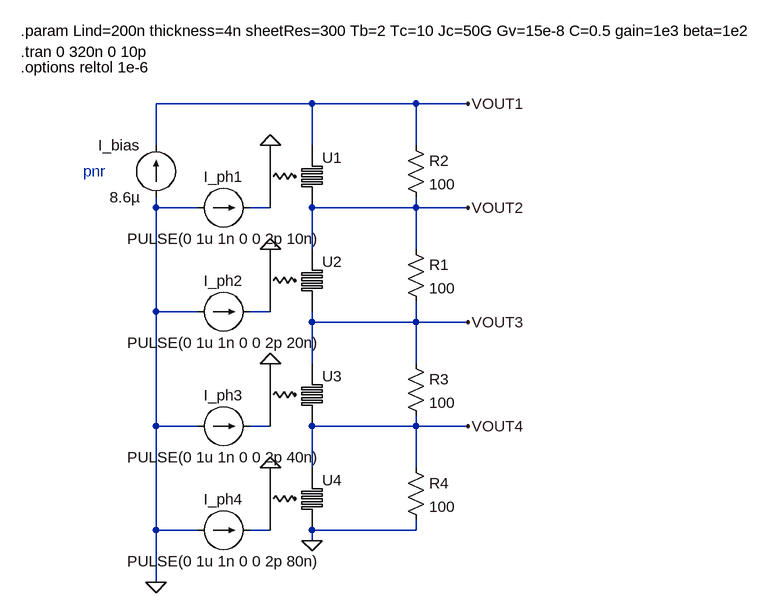
[diagram p0: schematic pnr-thermal.asc]
pnr-thermal.asc, the LTspice schematic file:
Version 4
SHEET 1 1508 680
WIRE -48 -608 -288 -608
WIRE 112 -608 -48 -608
WIRE 192 -608 112 -608
WIRE -288 -544 -288 -608
WIRE -48 -544 -48 -608
WIRE 112 -544 112 -608
WIRE -288 -448 -288 -464
WIRE -224 -448 -288 -448
WIRE -112 -448 -144 -448
WIRE 112 -448 112 -464
WIRE 112 -448 -48 -448
WIRE 192 -448 112 -448
WIRE -48 -384 -48 -448
WIRE 112 -384 112 -448
WIRE -288 -288 -288 -448
WIRE -224 -288 -288 -288
WIRE -112 -288 -144 -288
WIRE -48 -272 -48 -288
WIRE 112 -272 112 -304
WIRE 112 -272 -48 -272
WIRE 192 -272 112 -272
WIRE -48 -208 -48 -272
WIRE 112 -208 112 -272
WIRE -288 -112 -288 -288
WIRE -224 -112 -288 -112
WIRE -112 -112 -144 -112
WIRE -48 -112 -48 -128
WIRE 112 -112 112 -128
WIRE 112 -112 -48 -112
WIRE 192 -112 112 -112
WIRE -48 -48 -48 -112
WIRE 112 -48 112 -112
WIRE -288 48 -288 -112
WIRE -224 48 -288 48
WIRE -112 48 -144 48
WIRE 112 48 112 32
WIRE 112 48 -48 48
WIRE -48 64 -48 48
WIRE -288 128 -288 48
FLAG 192 -608 VOUT1
FLAG 192 -272 VOUT3
FLAG 192 -112 VOUT4
FLAG 192 -448 VOUT2
FLAG -48 64 0
FLAG -112 -544 0
FLAG -112 -384 0
FLAG -112 -208 0
FLAG -112 -48 0
FLAG -288 128 0
SYMBOL res 96 -560 R0
SYMATTR InstName R2
SYMATTR Value 100
SYMBOL current -288 -464 R180
WINDOW 0 24 80 Left 2
WINDOW 3 24 0 Left 2
WINDOW 123 0 0 Left 0
WINDOW 39 0 0 Left 0
SYMATTR InstName I_bias
SYMATTR Value 8.6µ
SYMBOL res 96 -400 R0
SYMATTR InstName R1
SYMATTR Value 100
SYMBOL res 96 -224 R0
SYMATTR InstName R3
SYMATTR Value 100
SYMBOL res 96 -64 R0
SYMATTR InstName R4
SYMATTR Value 100
SYMBOL snspd_photon_port -48 -336 R0
WINDOW 39 16 -1 Invisible 2
SYMATTR SpiceLine Lind={Lind} thickness={thickness} sheetRes={sheetRes} Tb={Tb} Tc={Tc}  Jc={Jc} Gv={Gv} C={C} gain= {gain} beta = {beta}
SYMATTR InstName U2
SYMBOL snspd_photon_port -48 -160 R0
WINDOW 39 -10 32 Invisible 2
SYMATTR SpiceLine Lind={Lind} thickness={thickness} sheetRes={sheetRes} Tb={Tb} Tc={Tc}  Jc={Jc} Gv={Gv} C={C} gain= {gain} beta = {beta}
SYMATTR InstName U3
SYMBOL snspd_photon_port -48 0 R0
WINDOW 39 -10 32 Invisible 2
SYMATTR SpiceLine Lind={Lind} thickness={thickness} sheetRes={sheetRes} Tb={Tb} Tc={Tc}  Jc={Jc} Gv={Gv} C={C} gain= {gain} beta = {beta}
SYMATTR InstName U4
SYMBOL current -224 -448 R270
WINDOW 0 32 40 VTop 2
WINDOW 3 -32 40 VBottom 2
SYMATTR InstName I_ph1
SYMATTR Value PULSE(0 1u 1n 0 0 2p 10n)
SYMBOL current -224 -288 R270
WINDOW 0 32 40 VTop 2
WINDOW 3 -32 40 VBottom 2
SYMATTR InstName I_ph2
SYMATTR Value PULSE(0 1u 1n 0 0 2p 20n)
SYMBOL current -224 -112 R270
WINDOW 0 32 40 VTop 2
WINDOW 3 -32 40 VBottom 2
SYMATTR InstName I_ph3
SYMATTR Value PULSE(0 1u 1n 0 0 2p 40n)
SYMBOL current -224 48 R270
WINDOW 0 32 40 VTop 2
WINDOW 3 -32 40 VBottom 2
SYMATTR InstName I_ph4
SYMATTR Value PULSE(0 1u 1n 0 0 2p 80n)
SYMBOL snspd_photon_port -48 -496 R0
WINDOW 39 -10 32 Invisible 2
SYMATTR SpiceLine Lind={Lind} thickness={thickness} sheetRes={sheetRes} Tb={Tb} Tc={Tc}  Jc={Jc} Gv={Gv} C={C} gain= {gain} beta = {beta}
SYMATTR InstName U1
TEXT -496 -688 Left 2 !.tran 0 320n 0 10p
TEXT -400 -504 Left 2 ;pnr
TEXT -496 -664 Left 2 !.options reltol 1e-6
TEXT -496 -720 Left 2 !.param Lind=200n thickness=4n sheetRes=300 Tb=2 Tc=10 Jc=50G Gv=15e-8 C=0.5 gain=1e3 beta=1e2

The netlist it stands for:
* pnr-thermal.asc
R2 VOUT1 VOUT2 100
I_bias 0 VOUT1 8.6µ
R1 VOUT2 VOUT3 100
R3 VOUT3 VOUT4 100
R4 VOUT4 0 100
XU2 0 N002 VOUT2 VOUT3 nanowireDynTherm Lind={Lind} thickness={thickness} sheetRes={sheetRes} Tb={Tb} Tc={Tc}  Jc={Jc} Gv={Gv} C={C} gain= {gain} beta = {beta}  ; pins gate-in photon-out ? ?
XU3 0 N003 VOUT3 VOUT4 nanowireDynTherm Lind={Lind} thickness={thickness} sheetRes={sheetRes} Tb={Tb} Tc={Tc}  Jc={Jc} Gv={Gv} C={C} gain= {gain} beta = {beta}  ; pins gate-in photon-out ? ?
XU4 0 N004 VOUT4 0 nanowireDynTherm Lind={Lind} thickness={thickness} sheetRes={sheetRes} Tb={Tb} Tc={Tc}  Jc={Jc} Gv={Gv} C={C} gain= {gain} beta = {beta}  ; pins gate-in photon-out ? ?
I_ph1 0 N001 PULSE(0 1u 1n 0 0 2p 10n)
I_ph2 0 N002 PULSE(0 1u 1n 0 0 2p 20n)
I_ph3 0 N003 PULSE(0 1u 1n 0 0 2p 40n)
I_ph4 0 N004 PULSE(0 1u 1n 0 0 2p 80n)
XU1 0 N001 VOUT1 VOUT2 nanowireDynTherm Lind={Lind} thickness={thickness} sheetRes={sheetRes} Tb={Tb} Tc={Tc}  Jc={Jc} Gv={Gv} C={C} gain= {gain} beta = {beta}  ; pins gate-in photon-out ? ?
.tran 0 320n 0 10p
* pnr
.options reltol 1e-6
.param Lind=200n thickness=4n sheetRes=300 Tb=2 Tc=10 Jc=50G Gv=15e-8 C=0.5 gain=1e3 beta=1e2
.lib snspd.lib
.backanno
.end

* Results of the author's LTspice run, read from the files saved beside the schematic
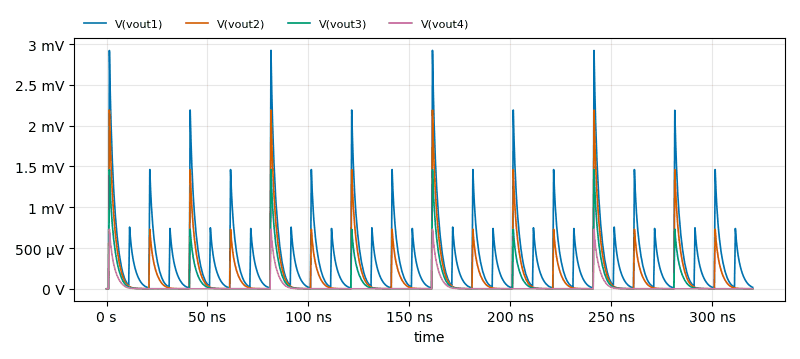
[diagram p1: Transient Analysis of pnr-thermal.asc, plotted from the saved traces]
* Transient Analysis, 1 run:
*   V(vout1): min 0 V, max 2.923 mV, average 362.6 µV, rms 583.8 µV, last 17.94 µV
*   V(vout2): min 0 V, max 2.192 mV, average 170.2 µV, rms 370.8 µV, last 238.5 nV
*   V(vout3): min 0 V, max 1.461 mV, average 72.94 µV, rms 214.1 µV, last 487.3 pV
*   V(vout4): min 0 V, max 730.6 µV, average 24.31 µV, rms 95.73 µV, last 0 V